# Altium schematic sheet GPSDO.SchDoc
size A3
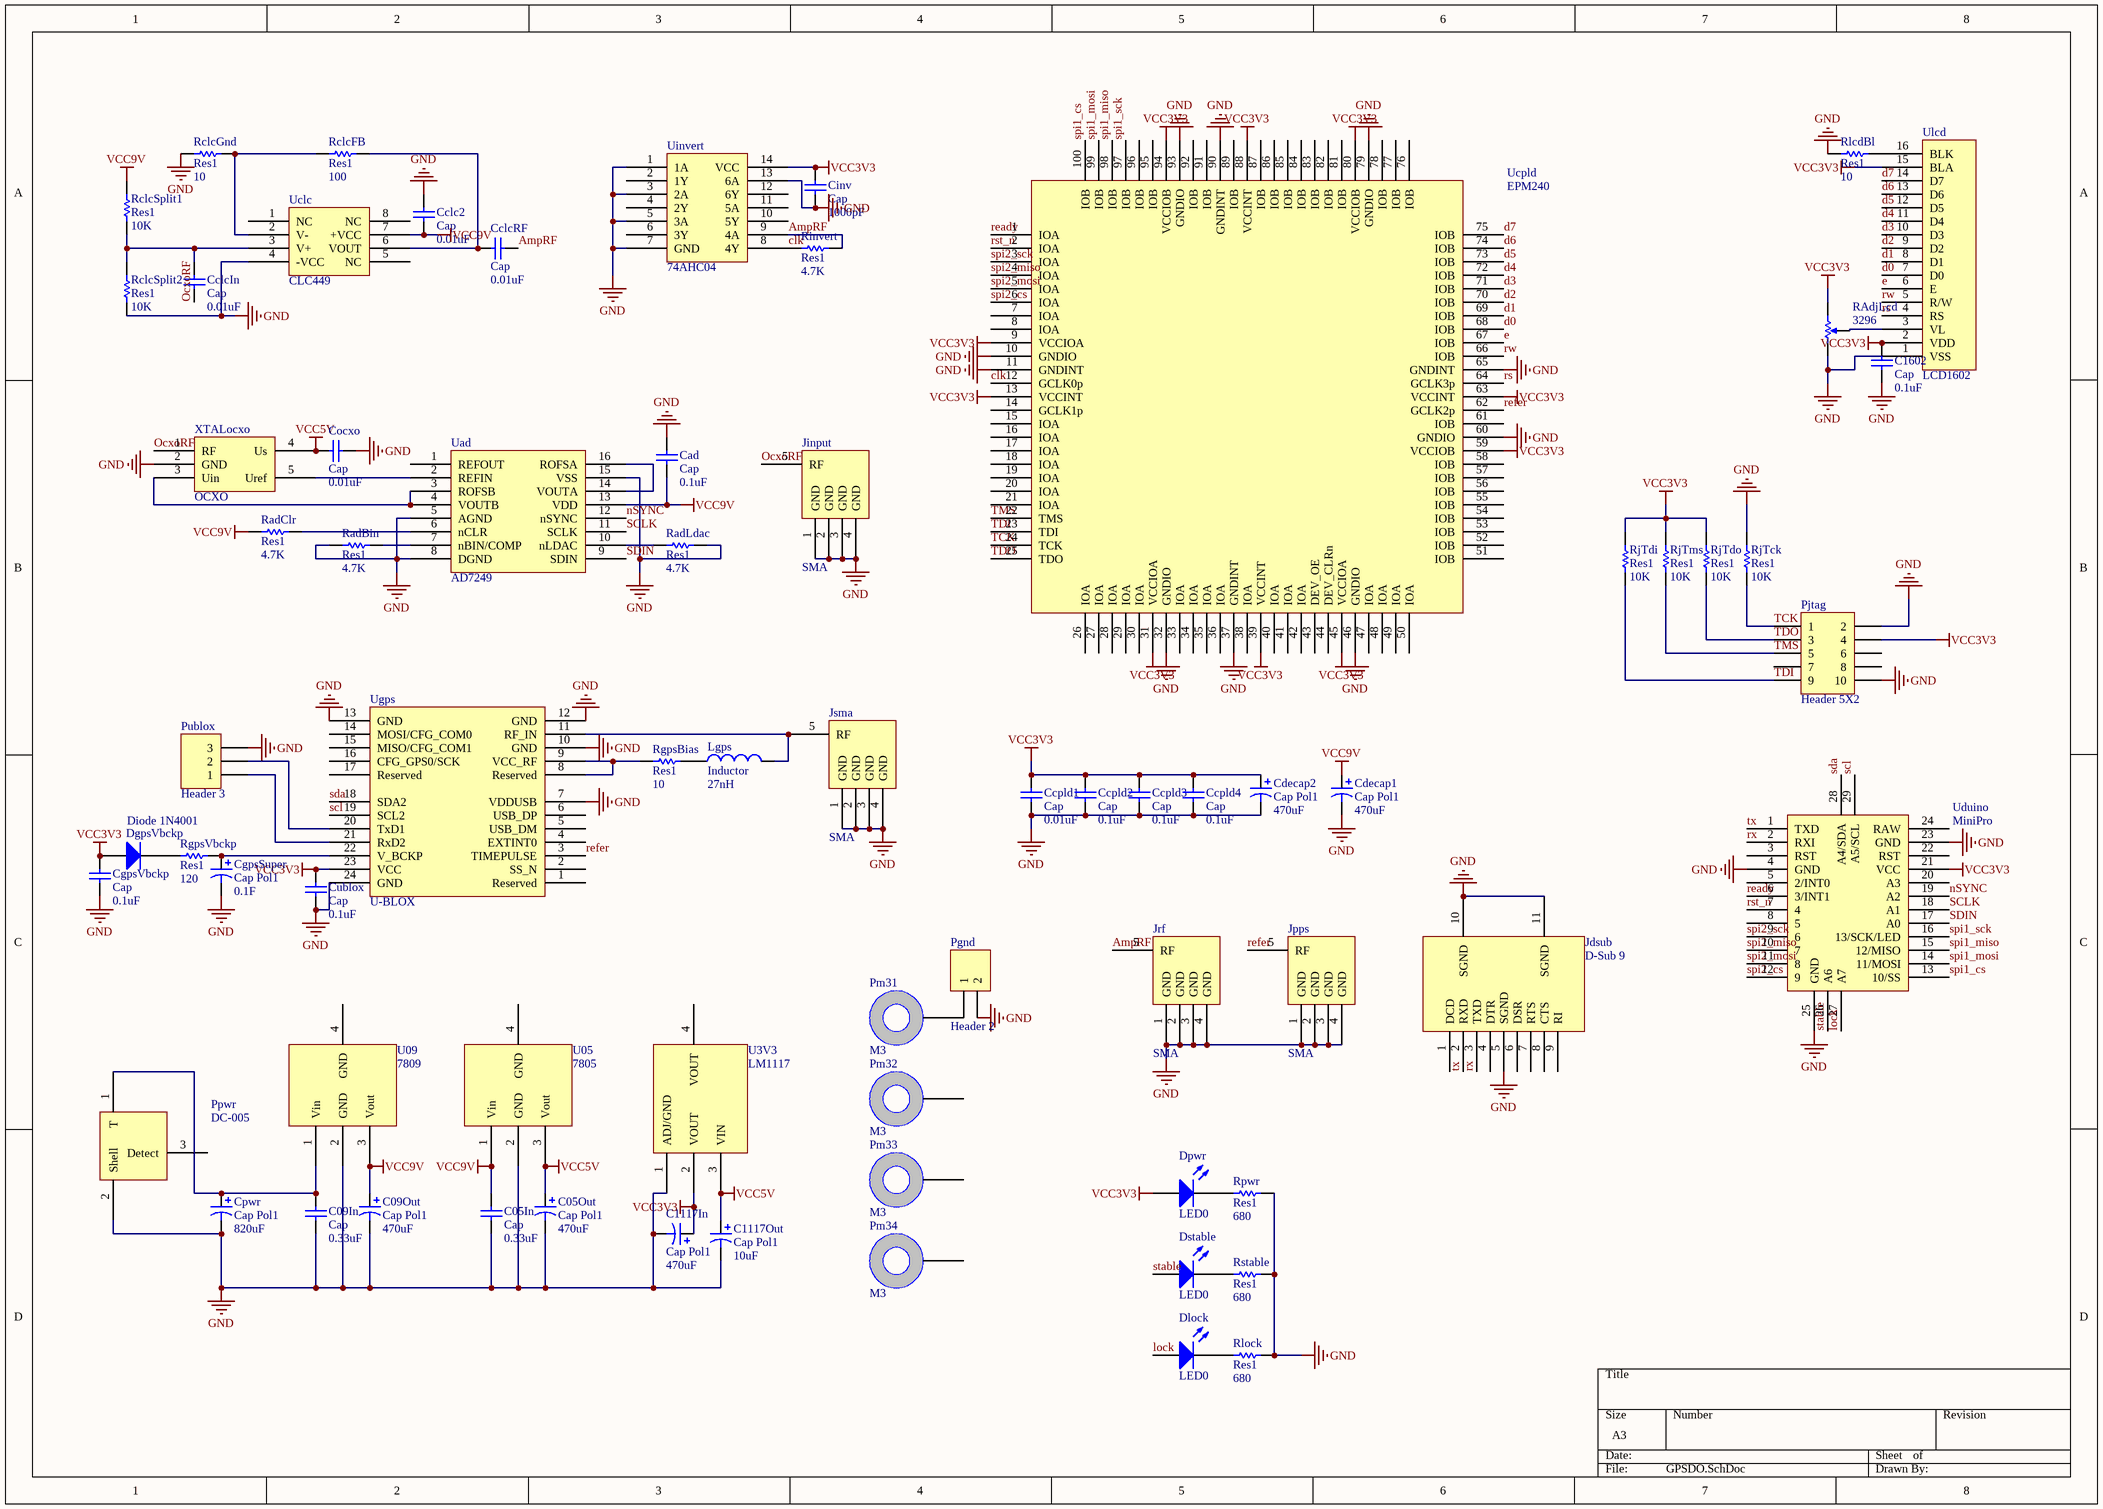
[diagram p0: GPSDO.SchDoc]

## Parts
C05In  Cap  value 0.33uF  [ERO MKC1858 0.33uF/63V]
C05Out  Cap Pol1  value 470uF  [SANYO SEP 560uF 10V]
C09In  Cap  value 0.33uF  [ERO MKC1858 0.33uF/63V]
C09Out  Cap Pol1  value 470uF  [SANYO SEP 560uF 10V]
C1117In  Cap Pol1  value 470uF  [SANYO SEP 560uF 10V]
C1117Out  Cap Pol1  value 10uF  [Nichicon FW 10uF 100V]
C1602  Cap  value 0.1uF  [BC MKT370 0.1uF/63V]
Cad  Cap  value 0.1uF  [BC MKT370 0.1uF/63V]
Cclc2  Cap  value 0.01uF  [BC MKT370 0.1uF/63V]
CclcIn  Cap  value 0.01uF  [0805.Cap.L]
CclcRF  Cap  value 0.01uF  [0805.Cap.L]
Ccpld1  Cap  value 0.01uF  [BC MKT370 0.1uF/63V]
Ccpld2  Cap  value 0.1uF  [BC MKT370 0.1uF/63V]
Ccpld3  Cap  value 0.1uF  [BC MKT370 0.1uF/63V]
Ccpld4  Cap  value 0.1uF  [BC MKT370 0.1uF/63V]
Cdecap1  Cap Pol1  value 470uF  [SANYO SEP 560uF 10V]
Cdecap2  Cap Pol1  value 470uF  [SANYO SEP 560uF 10V]
CgpsSuper  Cap Pol1  value 0.1F  [Panasonic SD 0.1F / 5.5V]
CgpsVbckp  Cap  value 0.1uF  [BC MKT370 0.1uF/63V]
Cinv  Cap  value 1000pF  [0805.Cap.L]
Cocxo  Cap  value 0.01uF  [BC MKT370 0.1uF/63V]
Cpwr  Cap Pol1  value 820uF  [NCC LXZ 820uF 25V]
Cublox  Cap  value 0.1uF  [BC MKT370 0.1uF/63V]
DgpsVbckp  Diode 1N4001  [1N4007]
Dlock  LED0  [3mm LED]
Dpwr  LED0  [3mm LED]
Dstable  LED0  [3mm LED]
Jdsub  D-Sub 9  [DSUB-9]
Jinput  SMA  [SMA]
Jpps  SMA  [SMA]
Jrf  SMA  [SMA]
Jsma  SMA  [SMA]
Lgps  Inductor  value 27nH  [0805.L.L]
Pgnd  Header 2  [HDR1X2]
Pjtag  Header 5X2  [DC3 2.54mm 10P]
Pm31  M3  [M3 Screw Mount]
Pm32  M3  [M3 Screw Mount]
Pm33  M3  [M3 Screw Mount]
Pm34  M3  [M3 Screw Mount]
Ppwr  DC-005  [DC-005]
Publox  Header 3  [HDR1X3]
RadBin  Res1  value 4.7K  [RJ24]
RadClr  Res1  value 4.7K  [RJ24]
RAdjLcd  3296  [3296W]
RadLdac  Res1  value 4.7K  [RJ24]
RclcFB  Res1  value 100  [0805.Res.L]
RclcGnd  Res1  value 10  [0805.Res.L]
RclcSplit1  Res1  value 10K  [0805.Res.L]
RclcSplit2  Res1  value 10K  [0805.Res.L]
RgpsBias  Res1  value 10  [0805.Res.L]
RgpsVbckp  Res1  value 120  [RJ24]
Rinvert  Res1  value 4.7K  [0805.Res.L]
RjTck  Res1  value 10K  [RJ24]
RjTdi  Res1  value 10K  [RJ24]
RjTdo  Res1  value 10K  [RJ24]
RjTms  Res1  value 10K  [RJ24]
RlcdBl  Res1  value 10  [RJ24]
Rlock  Res1  value 680  [RJ24]
Rpwr  Res1  value 680  [RJ24]
Rstable  Res1  value 680  [RJ24]
U3V3  LM1117  [LM1117 SOT-223]
U05  7805  [MC7805]
U09  7809  [MC7805]
Uad  AD7249  [AD7249 SOIC-16]
Uclc  CLC449  [CLC449 SOIC-8]
Ucpld  EPM240  [EPM240/570 TQFP-100]
Uduino  MiniPro  [DIP24 - Arduino]
Ugps  U-BLOX  [NEO-GPS]
Uinvert  74AHC04  [74AHC04 SOP-14]
Ulcd  LCD1602  [LCD1602]
XTALocxo  OCXO  [MV85]

## Nets
GND: C05In.2 C05Out.2 C09In.1 C09Out.2 C1117In.2 C1117Out.2 C1602.1 Cad.2 Cclc2.2 Ccpld1.1 Ccpld2.1 Ccpld3.1 Ccpld4.1 Cdecap1.2 Cdecap2.2 CgpsSuper.2 CgpsVbckp.1 Cinv.1 Cocxo.2 Cpwr.2 Cublox.1 Jdsub.5(SGND) Jdsub.10(SGND) Jdsub.11(SGND) Jinput.1(GND) Jinput.2(GND) Jinput.3(GND) Jinput.4(GND) Jpps.1(GND) Jpps.2(GND) Jpps.3(GND) Jpps.4(GND) Jrf.1(GND) Jrf.2(GND) Jrf.3(GND) Jrf.4(GND) Jsma.1(GND) Jsma.2(GND) Jsma.3(GND) Jsma.4(GND) Pgnd.2 Pjtag.2 Pjtag.10 Ppwr.2(Shell) Publox.3 RadBin.1 RAdjLcd.3(CW) RadLdac.2 RclcGnd.1 RclcSplit2.1 RjTck.2 RlcdBl.1 Rlock.2 Rpwr.2 Rstable.2 U3V3.1(ADJ/GND) U05.2(GND) U09.2(GND) Uad.5(AGND) Uad.8(DGND) Uad.15(VSS) Uclc.4(-VCC) Ucpld.10(GNDIO) Ucpld.11(GNDINT) Ucpld.32(GNDIO) Ucpld.37(GNDINT) Ucpld.46(GNDIO) Ucpld.60(GNDIO) Ucpld.65(GNDINT) Ucpld.79(GNDIO) Ucpld.90(GNDINT) Ucpld.93(GNDIO) Uduino.4(GND) Uduino.23(GND) Uduino.25(GND) Ugps.7(VDDUSB) Ugps.10(GND) Ugps.12(GND) Ugps.13(GND) Ugps.24(GND) Uinvert.1(1A) Uinvert.3(2A) Uinvert.5(3A) Uinvert.7(GND) Uinvert.13(6A) Ulcd.1(VSS) XTALocxo.2(GND)
VCC3V3: C1117In.1 C1602.2 Ccpld1.2 Ccpld2.2 Ccpld3.2 Ccpld4.2 Cdecap2.1 CgpsVbckp.2 Cinv.2 Cublox.2 DgpsVbckp.1(A) Dpwr.1(A) Pjtag.4 RAdjLcd.1(CCW) RjTdi.2 RjTdo.2 RjTms.2 U3V3.2(VOUT) Ucpld.9(VCCIOA) Ucpld.13(VCCINT) Ucpld.31(VCCIOA) Ucpld.39(VCCINT) Ucpld.45(VCCIOA) Ucpld.59(VCCIOB) Ucpld.63(VCCINT) Ucpld.80(VCCIOB) Ucpld.88(VCCINT) Ucpld.94(VCCIOB) Uduino.21(VCC) Ugps.23(VCC) Uinvert.14(VCC) Ulcd.2(VDD) Ulcd.15(BLA)
VCC5V: C05Out.1 C1117Out.1 Cocxo.1 U3V3.3(VIN) U05.3(Vout) XTALocxo.4(Us)
VCC9V: C05In.1 C09Out.1 Cad.1 Cclc2.1 Cdecap1.1 RadClr.1 RclcSplit1.2 U05.1(Vin) U09.3(Vout) Uad.13(VDD) Uclc.7(+VCC)
AmpRF: CclcRF.2 Jrf.5(RF) Rinvert.2 Uinvert.9(4A)
clk: Rinvert.1 Ucpld.12(GCLK0p) Uinvert.8(4Y)
d0: Ucpld.68(IOB) Ulcd.7(D0)
d1: Ucpld.69(IOB) Ulcd.8(D1)
d2: Ucpld.70(IOB) Ulcd.9(D2)
d3: Ucpld.71(IOB) Ulcd.10(D3)
d4: Ucpld.72(IOB) Ulcd.11(D4)
d5: Ucpld.73(IOB) Ulcd.12(D5)
d6: Ucpld.74(IOB) Ulcd.13(D6)
d7: Ucpld.75(IOB) Ulcd.14(D7)
e: Ucpld.67(IOB) Ulcd.6(E)
lock: Dlock.1(A) Uduino.27(A7)
nSYNC: Uad.12(nSYNC) Uduino.19(A2)
OcxoRF: CclcIn.1 Jinput.5(RF) XTALocxo.1(RF)
ready: Ucpld.1(IOA) Uduino.6(3/INT1)
refer: Jpps.5(RF) Ucpld.62(GCLK2p) Ugps.3(TIMEPULSE)
rs: Ucpld.64(GCLK3p) Ulcd.4(RS)
rst_n: Ucpld.2(IOA) Uduino.7(4)
rw: Ucpld.66(IOB) Ulcd.5(R/W)
rx: Jdsub.3(TXD) Uduino.2(RXI)
scl: Uduino.29(A5/SCL) Ugps.19(SCL2)
SCLK: Uad.11(SCLK) Uduino.18(A1)
sda: Uduino.28(A4/SDA) Ugps.18(SDA2)
SDIN: Uad.9(SDIN) Uduino.17(A0)
spi1_cs: Ucpld.100(IOB) Uduino.13(10/SS)
spi1_miso: Ucpld.98(IOB) Uduino.15(12/MISO)
spi1_mosi: Ucpld.99(IOB) Uduino.14(11/MOSI)
spi1_sck: Ucpld.97(IOB) Uduino.16(13/SCK/LED)
spi2_cs: Ucpld.6(IOA) Uduino.12(9)
spi2_miso: Ucpld.4(IOA) Uduino.10(7)
spi2_mosi: Ucpld.5(IOA) Uduino.11(8)
spi2_sck: Ucpld.3(IOA) Uduino.9(6)
stable: Dstable.1(A) Uduino.26(A6)
TCK: Pjtag.1 RjTck.1 Ucpld.24(TCK)
TDI: Pjtag.9 RjTdi.1 Ucpld.23(TDI)
TDO: Pjtag.3 RjTdo.1 Ucpld.25(TDO)
TMS: Pjtag.5 RjTms.1 Ucpld.22(TMS)
tx: Jdsub.2(RXD) Uduino.1(TXD)
NetC09In_2: C09In.2 Cpwr.1 Ppwr.1(T) U09.1(Vin)
NetCclcIn_2: CclcIn.2 RclcSplit1.1 RclcSplit2.2 Uclc.3(V+)
NetCclcRF_1: CclcRF.1 RclcFB.2 Uclc.6(VOUT)
NetCgpsSuper_1: CgpsSuper.1 RgpsVbckp.2 Ugps.22(V_BCKP)
NetDgpsVbckp_2: DgpsVbckp.2(K) RgpsVbckp.1
NetDlock_2: Dlock.2(K) Rlock.1
NetDpwr_2: Dpwr.2(K) Rpwr.1
NetDstable_2: Dstable.2(K) Rstable.1
NetJsma_5: Jsma.5(RF) Lgps.2 Ugps.11(RF_IN)
NetLgps_1: Lgps.1 RgpsBias.2
NetPgnd_1: Pgnd.1 Pm31.1(GND)
NetPublox_1: Publox.1 Ugps.21(RxD2)
NetPublox_2: Publox.2 Ugps.20(TxD1)
NetRadBin_2: RadBin.2 Uad.7(nBIN/COMP)
NetRadClr_2: RadClr.2 Uad.6(nCLR)
NetRAdjLcd_2: RAdjLcd.2(WIPER) Ulcd.3(VL)
NetRadLdac_1: RadLdac.1 Uad.10(nLDAC)
NetRclcFB_1: RclcFB.1 RclcGnd.2 Uclc.2(V-)
NetRgpsBias_1: RgpsBias.1 Ugps.8(Reserved) Ugps.9(VCC_RF)
NetRlcdBl_2: RlcdBl.2 Ulcd.16(BLK)
NetUad_2: Uad.2(REFIN) XTALocxo.5(Uref)
NetUad_3: Uad.3(ROFSB) Uad.4(VOUTB) XTALocxo.3(Uin)
NetUad_14: Uad.14(VOUTA) Uad.16(ROFSA)

Not connected (* = marked no-connect by the designer): Jdsub 1(DCD) 4(DTR) 6(DSR) 7(RTS) 8(CTS) 9(RI); Pjtag 6 7 8; Pm32 1(GND); Pm33 1(GND); Pm34 1(GND); Ppwr 3(Detect); U3V3 4(VOUT); U05 4(GND); U09 4(GND); Uad 1(REFOUT); Uclc 1(NC) 5(NC) 8(NC); Ucpld 7(IOA) 8(IOA) 14(GCLK1p) 15(IOA) 16(IOA) 17(IOA) 18(IOA) 19(IOA) 20(IOA) 21(IOA) 26(IOA) 27(IOA) 28(IOA) 29(IOA) 30(IOA) 33(IOA) 34(IOA) 35(IOA) 36(IOA) 38(IOA) 40(IOA) 41(IOA) 42(IOA) 43(DEV_OE) 44(DEV_CLRn) 47(IOA) 48(IOA) 49(IOA) 50(IOA) 51(IOB) 52(IOB) 53(IOB) 54(IOB) 55(IOB) 56(IOB) 57(IOB) 58(IOB) 61(IOB) 76(IOB) 77(IOB) 78(IOB) 81(IOB) 82(IOB) 83(IOB) 84(IOB) 85(IOB) 86(IOB) 87(IOB) 89(IOB) 91(IOB) 92(IOB) 95(IOB) 96(IOB); Uduino 3(RST) 5(2/INT0) 8(5) 20(A3) 22(RST) 24(RAW); Ugps 1(Reserved) 2(SS_N) 4(EXTINT0) 5(USB_DM) 6(USB_DP) 14(MOSI/CFG_COM0) 15(MISO/CFG_COM1) 16(CFG_GPS0/SCK) 17(Reserved); Uinvert 2(1Y) 4(2Y) 6(3Y) 10(5Y) 11(5A) 12(6Y)

## Library data of the parts
C05In C09In C1602 Cad Cclc2 CclcIn CclcRF Ccpld1-Ccpld4 CgpsVbckp Cinv Cocxo Cublox = Cap: Capacitor; Published: 8-Jun-2000; LatestRevisionDate: 17-Jul-2002; LatestRevisionNote: Re-released for DXP Platform.; PackageReference: RAD-0.3; Publisher: Altium Limited
C05Out C09Out C1117In C1117Out Cdecap1 Cdecap2 CgpsSuper Cpwr = Cap Pol1: Polarized Capacitor (Radial); Published: 8-Jun-2000; LatestRevisionDate: 17-Jul-2002; LatestRevisionNote: Re-released for DXP Platform.; PackageReference: RB7.6-15; Publisher: Altium Limited
DgpsVbckp = Diode 1N4001: 1 Amp General Purpose Rectifier; Published: 8-Jun-2000; LatestRevisionDate: 17-Jul-2002; LatestRevisionNote: Re-released for DXP Platform.; DatasheetVersion: 1998; PackageVersion: Aug-1999; PackageReference: DO-41; Publisher: Altium Limited; Code_JEDEC: DO-204-AL; ComponentLink1Description: Manufacturer Link; ComponentLink1URL: http://www.fairchildsemi.com/; ComponentLink2Description: Datasheet; ComponentLink2URL: http://www.fairchildsemi.com/ds/1N%2F1N4001.pdf
Dlock Dpwr Dstable = LED0: Typical INFRARED GaAs LED; Published: 8-Jun-2000; LatestRevisionDate: 08-Jul-2005; LatestRevisionNote: Mech Layer 1 removed.; PackageReference: LED-0; Publisher: Altium Limited
Lgps = Inductor: Code_IEC: 1005; Published: 8-Jun-2000; LatestRevisionDate: 29-May-2009; LatestRevisionNote: IPC-7351 Footprint Added.; PackageReference: 0402-A; Publisher: Altium Limited; PackageDescription: Chip Inductor; Code_JEITA: 0402
Pgnd = Header 2: Header, 2-Pin; LatestRevisionDate: 17-Jul-2002; LatestRevisionNote: Re-released for DXP Platform.; Publisher: Altium Limited
Pjtag = Header 5X2: Header, 5-Pin, Dual row; LatestRevisionDate: 17-Jul-2002; LatestRevisionNote: Re-released for DXP Platform.; Publisher: Altium Limited
Pm31-Pm34 = M3 Screw Mount: M3 screw mount, hole d: 3.5mm
Publox = Header 3: Header, 3-Pin; LatestRevisionDate: 17-Jul-2002; LatestRevisionNote: Re-released for DXP Platform.; Publisher: Altium Limited
RadBin RadClr RadLdac RclcFB RclcGnd RclcSplit1 RclcSplit2 RgpsBias RgpsVbckp Rinvert RjTck RjTdi RjTdo RjTms RlcdBl Rlock Rpwr Rstable = Res1: Resistor; Published: 8-Jun-2000; LatestRevisionDate: 17-Jul-2002; LatestRevisionNote: Re-released for DXP Platform.; PackageReference: AXIAL-0.3; Publisher: Altium Limited
RAdjLcd = Trimming Potentiometer: 3296 - 3/8" Square Trimming Potentiometer
U3V3 = LM1117: LM1117-N/LM1117I 800mA Low-Dropout Linear Regulator
U05 U09 = MC7805: 1.0 A Positive Voltage  Regulators
Uad = AD7249: LC2MOS Dual 12-Bit Serial DACPORT
Uclc = CLC449: 1.1GHz Ultra Wideband Monolithic Op Amp
Ucpld = EPM240: Altera Max II CPLD
Uduino = ArduinoMiniPro: Microcontroller board based on the ATmega328P
Ugps = NEO-GPS: u-blox 6 GPS Modules
Uinvert = 74AHC04: hex inverter